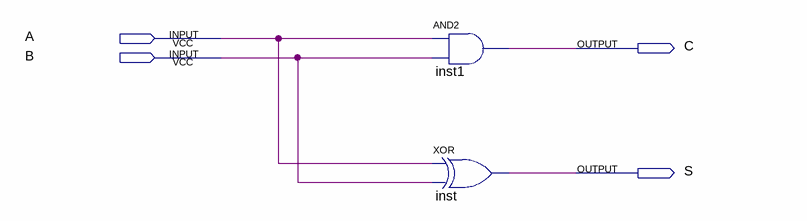
[diagram p0: schematic sheet]
// Quartus schematic Half_Adder.bdf as structural Verilog: 2 symbols, 4 pins
module Half_Adder (
  input  A,
  input  B,
  output C,
  output S
);

  and inst1 (C, A, B);
  xor inst (S, A, B);
endmodule
